# Altium schematic sheet QCopterMV_DCMI_Sch.SchDoc: QCopterMV-DCMI
size 127 x 101 mm; Author: Hom; CompanyName: KitSprout; DrawnBy: Hom; Engineer: Hom; Organization: KitSprout; Revision: A; SheetNumber: 1; SheetTotal: 1; License: CC BY-SA 4.0; Version: 2.0; LibVersion: 2.7; PageSetup: Record=PageOptions|CenterHorizontal=True|CenterVertical=True|PrintScale=1.00|XCorrection=1.00|YCorrection=1.00|PrintKind=0|BorderSize=5000000|LeftOffset=0|BottomOffset=0|Orientation=2|PaperLength=1000|PaperWidth=1000|Scale=100|PaperSource=7|PrintQuality=-4|MediaType=1|DitherType=10|PaperKind=A4|PrintScaleMode=0
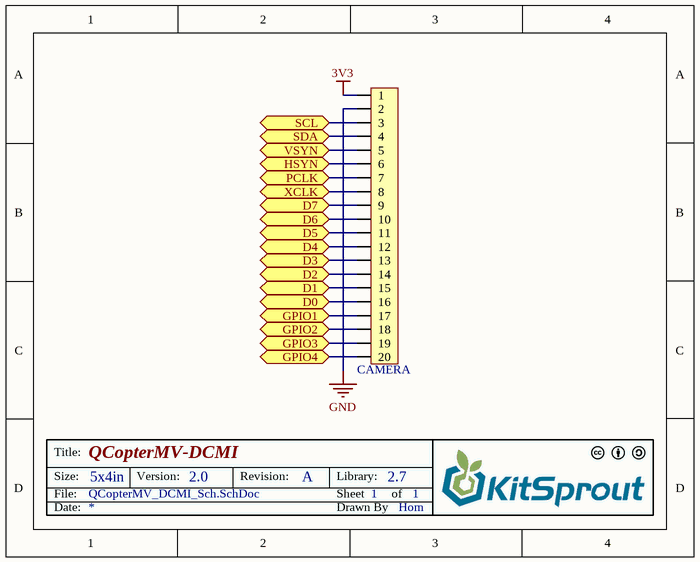
[diagram p0: QCopterMV_DCMI_Sch.SchDoc]

## Parts
CAMERA  HDR1x20_1.27  [HDR1X20_1.27_180F]  (value not drawn)

## Ports
D0, D1, D2, D3, D4, D5, D6, D7, GPIO1, GPIO2, GPIO3, GPIO4, HSYN, PCLK, SCL, SDA, VSYN, XCLK

## Nets
3V3: CAMERA.1
GND: CAMERA.2
D0: CAMERA.16 ; port D0
D1: CAMERA.15 ; port D1
D2: CAMERA.14 ; port D2
D3: CAMERA.13 ; port D3
D4: CAMERA.12 ; port D4
D5: CAMERA.11 ; port D5
D6: CAMERA.10 ; port D6
D7: CAMERA.9 ; port D7
GPIO1: CAMERA.17 ; port GPIO1
GPIO2: CAMERA.18 ; port GPIO2
GPIO3: CAMERA.19 ; port GPIO3
GPIO4: CAMERA.20 ; port GPIO4
HSYN: CAMERA.6 ; port HSYN
PCLK: CAMERA.7 ; port PCLK
SCL: CAMERA.3 ; port SCL
SDA: CAMERA.4 ; port SDA
VSYN: CAMERA.5 ; port VSYN
XCLK: CAMERA.8 ; port XCLK

## Notes on the sheet
- Title:
- Size:
- Date:
- File:
- 5x4in
- Version:
- Revision:
- Sheet
- Drawn By
- Library:
- of

## Library data of the parts
CAMERA = HDR1x20_1.27: Header